# EAGLE design LB_BIT_i15_LIGHTTRIGGER-v03(rev3_2x) (EAGLE 6.1)
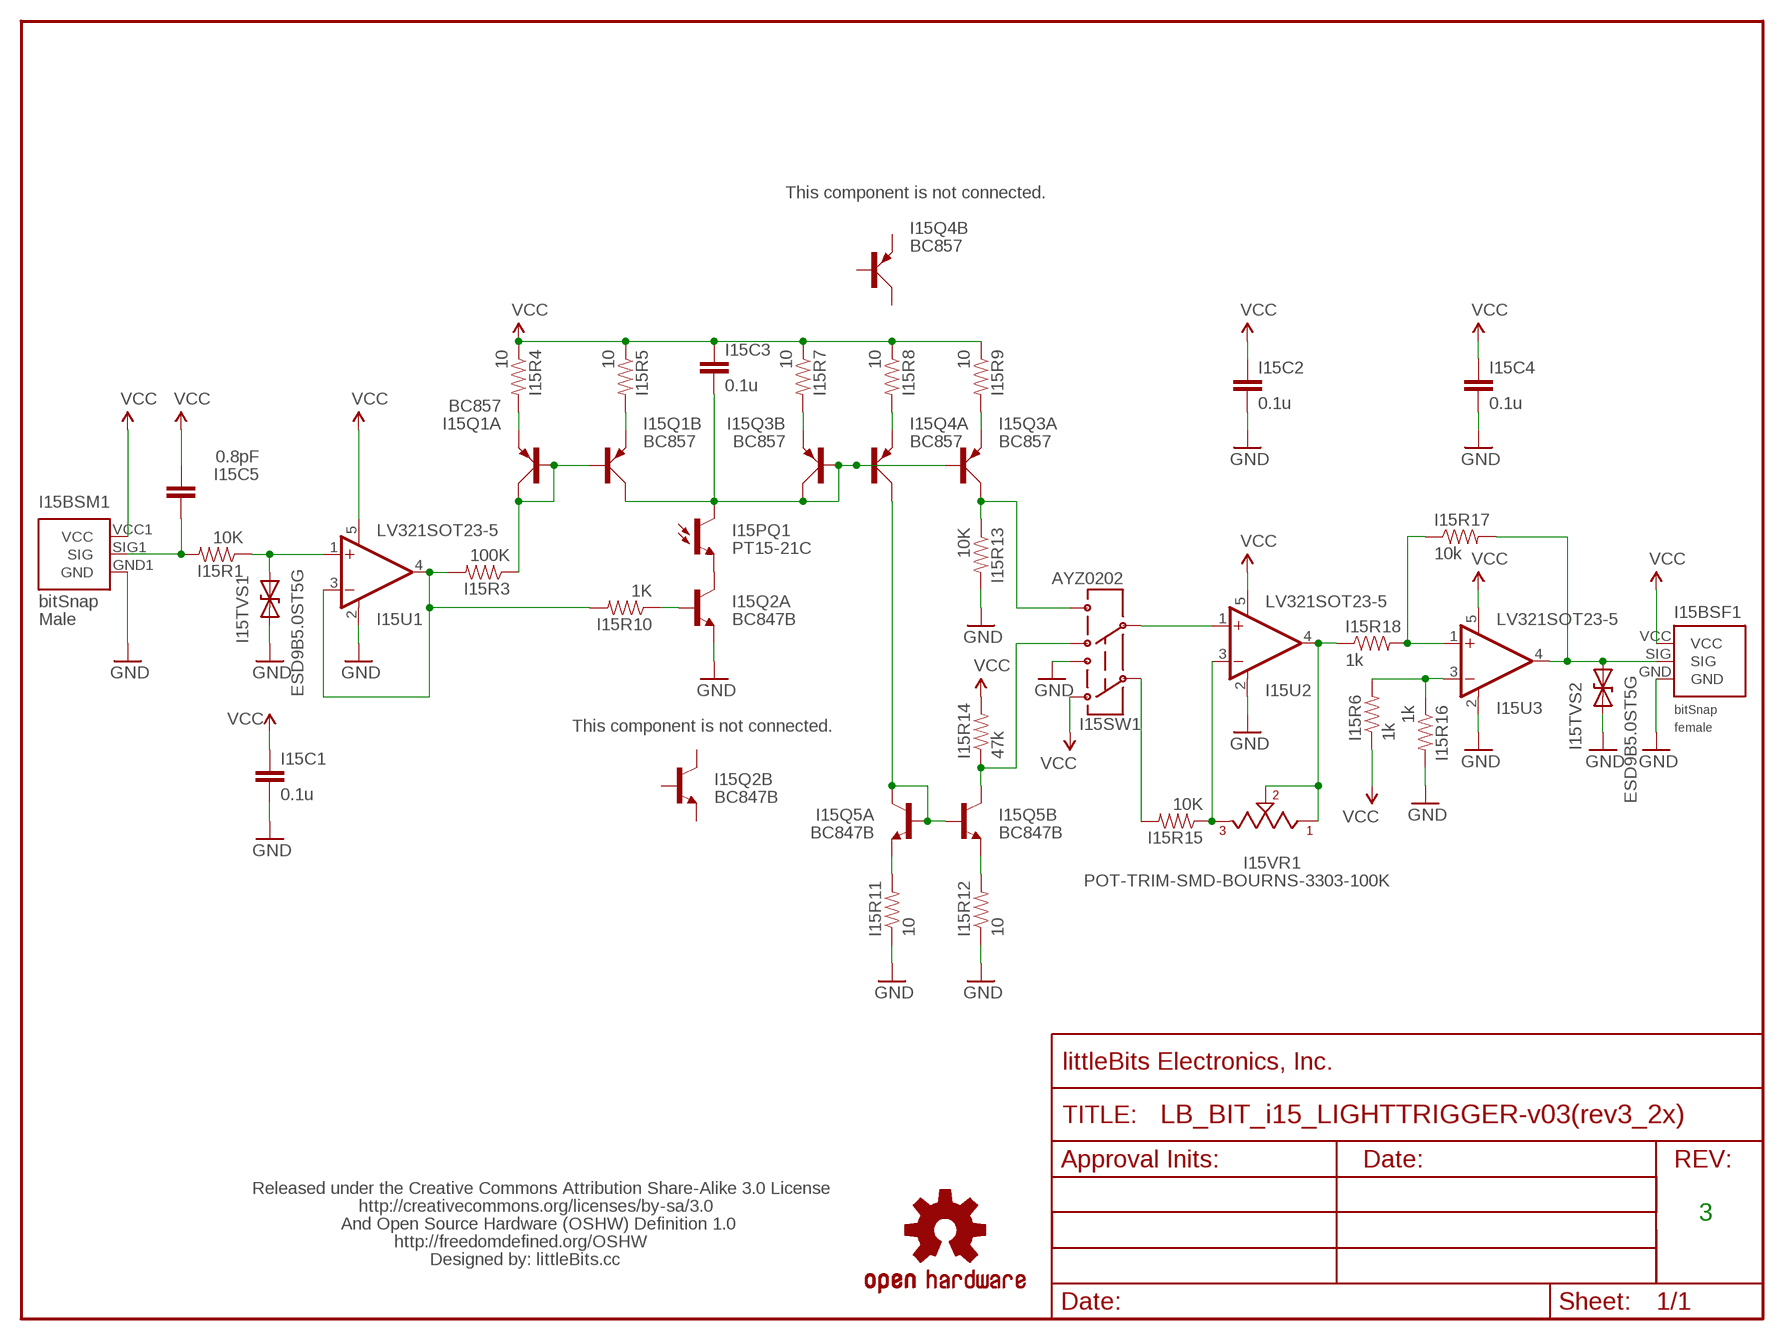
[diagram p0: schematic, sheet 1]

## Parts
FRAME1  FRAME-LETTER-OHWOHW  [FABDWG01-OHW]
I15BSF1  BITSNAP_V03_FEMALE  [BITSNAP_V03_FEMALE]
I15BSM1  BITSNAP_V03_MALE  [BITSNAP_V03_MALE]
I15C1  0.1u  CAPCAP-0603  [CAP-0603]
I15C2  0.1u  CAPCAP-0603  [CAP-0603]
I15C3  0.1u  CAPCAP-0603  [CAP-0603]
I15C4  0.1u  CAPCAP-0603  [CAP-0603]
I15C5  0.8pF  CAPCAP-0603  [CAP-0603]
I15PQ1  PT15-21C  TRANS-PHOTO  [PHOTOTRANS-1206]
I15Q1  BC857  TRANS-BJT_PNP-DUALBC857  [SOT-363_PHILLIPS]
I15Q2  BC847B  TRANS-BJT_NPN-DUALBC847BS  [SOT-363_PHILLIPS]
I15Q3  BC857  TRANS-BJT_PNP-DUALBC857  [SOT-363_PHILLIPS]
I15Q4  BC857  TRANS-BJT_PNP-DUALBC857  [SOT-363_PHILLIPS]
I15Q5  BC847B  TRANS-BJT_NPN-DUALBC847BS  [SOT-363_PHILLIPS]
I15R1  10K  RESISTOR0603  [RES-0603]
I15R3  100K  RESISTOR0603  [RES-0603]
I15R4  10  RESISTOR0603  [RES-0603]
I15R5  10  RESISTOR0603  [RES-0603]
I15R6  1k  RES-0603  [RES-0603]
I15R7  10  RESISTOR0603  [RES-0603]
I15R8  10  RESISTOR0603  [RES-0603]
I15R9  10  RESISTOR0603  [RES-0603]
I15R10  1K  RESISTOR0603  [RES-0603]
I15R11  10  RESISTOR0603  [RES-0603]
I15R12  10  RESISTOR0603  [RES-0603]
I15R13  10K  RESISTOR0603  [RES-0603]
I15R14  47k  RESISTOR0603  [RES-0603]
I15R15  10K  RES-0603  [RES-0603]
I15R16  1k  RES-0603  [RES-0603]
I15R17  10k  RES-0603  [RES-0603]
I15R18  1k  RES-0603  [RES-0603]
I15SW1  AYZ0202  [AYZ0202]
I15TVS1  ESD9B5.0ST5G  DIODE-TVSSOD-923  [SOD-923]
I15TVS2  ESD9B5.0ST5G  DIODE-TVSSOD-923  [SOD-923]
I15U1  LV321SOT23-5  [SOT23-5]
I15U2  LV321SOT23-5  [SOT23-5]
I15U3  LV321SOT23-5  [SOT23-5]
I15VR1  POT-TRIM-SMD-BOURNS-3303-100K  POT-TRIM-SMD-BOURNS-3303  [POT-TRIM-SMD-BOURNS-3303]
U$1  OSHWCREDIT  [OSHWCREDIT]
U$2  OSHW-LOGOL  [OSHW-LOGO-L]

## Nets
GND: I15BSF1.GND I15BSM1.GND1(GND) I15C1.2 I15C2.2 I15C4.2 I15Q2.1(A:E) I15R11.1 I15R12.1 I15R13.2 I15R16.2 I15SW1.3 I15TVS1.1(A) I15TVS2.1(A) I15U1.2(V-) I15U2.2(V-) I15U3.2(V-)
N$1: I15Q5.3(B:C) I15R14.1 I15SW1.4
N$2: I15Q5.1(A:E) I15R11.2
N$3: I15Q4.6(A:C) I15Q5.2(A:B) I15Q5.5(B:B) I15Q5.6(A:C)
N$4: I15Q5.4(B:E) I15R12.2
N$5: I15BSM1.SIG1(SIG) I15C5.1 I15R1.2
N$6: I15R15.1 I15U2.3(-IN) I15VR1.3
N$7: I15R18.1 I15U2.4(OUT) I15VR1.1 I15VR1.2
N$8: I15R3.2 I15R10.2 I15U1.3(-IN) I15U1.4(OUT)
N$9: I15Q1.2(A:B) I15Q1.5(B:B) I15Q1.6(A:C) I15R3.1
N$10: I15Q1.1(A:E) I15R4.2
N$11: I15Q1.4(B:E) I15R5.2
N$12: I15Q3.4(B:E) I15R7.2
N$13: I15C3.2 I15PQ1.C I15Q1.3(B:C) I15Q3.2(A:B) I15Q3.3(B:C) I15Q3.5(B:B) I15Q4.2(A:B)
N$14: I15Q4.1(A:E) I15R8.2
N$15: I15Q3.1(A:E) I15R9.2
N$16: I15SW1.5 I15U2.1(+IN)
N$17: I15R15.2 I15SW1.2
N$18: I15PQ1.E I15Q2.6(A:C)
N$19: I15Q3.6(A:C) I15R13.1 I15SW1.6
N$20: I15Q2.2(A:B) I15R10.1
N$21: I15R1.1 I15TVS1.2(C) I15U1.1(+IN)
N$22: I15R6.2 I15R16.1 I15U3.3(-IN)
N$23: I15R17.1 I15R18.2 I15U3.1(+IN)
N$24: I15BSF1.SIG I15R17.2 I15TVS2.2(C) I15U3.4(OUT)
VCC: I15BSF1.VCC I15BSM1.VCC1(VCC) I15C1.1 I15C2.1 I15C3.1 I15C4.1 I15C5.2 I15R4.1 I15R5.1 I15R6.1 I15R7.1 I15R8.1 I15R9.1 I15R14.2 I15SW1.1 I15U1.5(V+) I15U2.5(V+) I15U3.5(V+)
Unconnected: I15Q2.3(B:C) I15Q2.4(B:E) I15Q2.5(B:B) I15Q4.3(B:C) I15Q4.4(B:E) I15Q4.5(B:B)

## Notes on the sheet
- This component is not connected.
- This component is not connected.
- 3

## Library data of the parts
FRAME1 = LITTLEBITS:FRAME-LETTER-OHW
I15BSF1 = bitSnap:BITSNAP_V03_FEMALE
I15BSM1 = bitSnap:BITSNAP_V03_MALE
I15C1-I15C5 = LITTLEBITS:CAP
I15PQ1 = LITTLEBITS:TRANS-PHOTO
I15Q1 I15Q3 I15Q4 = LITTLEBITS:TRANS-BJT_PNP-DUAL
I15Q2 I15Q5 = LITTLEBITS:TRANS-BJT_NPN-DUAL
I15R1 I15R3-I15R5 I15R7-I15R14 = LITTLEBITS:RESISTOR
I15R6 I15R15-I15R18 = LITTLEBITS:RES-0603: Resistor
I15SW1 = LITTLEBITS:AYZ0202
I15TVS1 I15TVS2 = LITTLEBITS:DIODE-TVS: Bidirectional Transient Voltage Suppression Diode: Device conducts in avalanche mode after reaching a part dependent voltage threshold. Used for limiting voltage spikes on ESD sensitive inputs and outputs.; IEC_ESD_PROT0: +/-18kV; LB_PN: ?; MPN: ESD9B5.0ST5G; V_CLAMP: ?; V_OPERATION: 5V
I15U1-I15U3 = LITTLEBITS:LV321
I15VR1 = LITTLEBITS:POT-TRIM-SMD-BOURNS-3303
U$1 = LITTLEBITS:OSHWCREDIT
U$2 = LITTLEBITS:OSHW-LOGO: Open Source Hardware Logo This logo indicates the piece of hardware it is found on incorporates a OSHW license and/or adheres to the definition of open source hardware found here: http://freedomdefined.org/OSHW

## Board
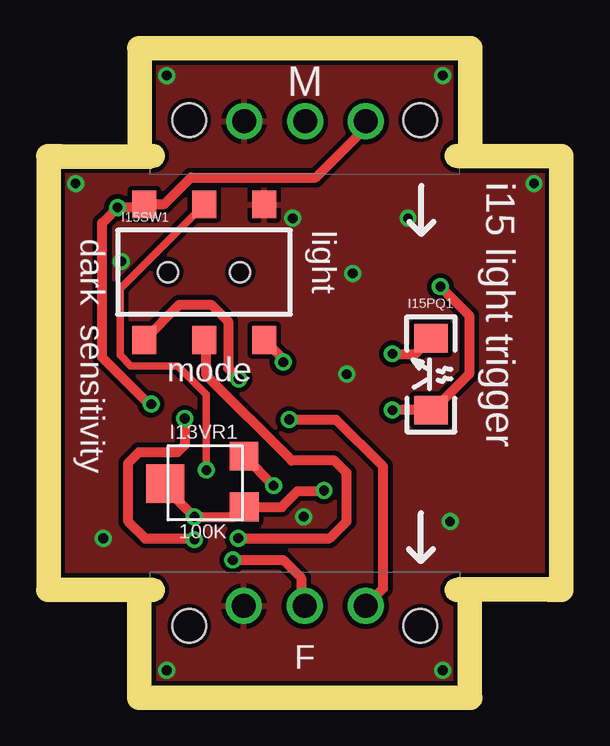
[diagram p1: board, top side]
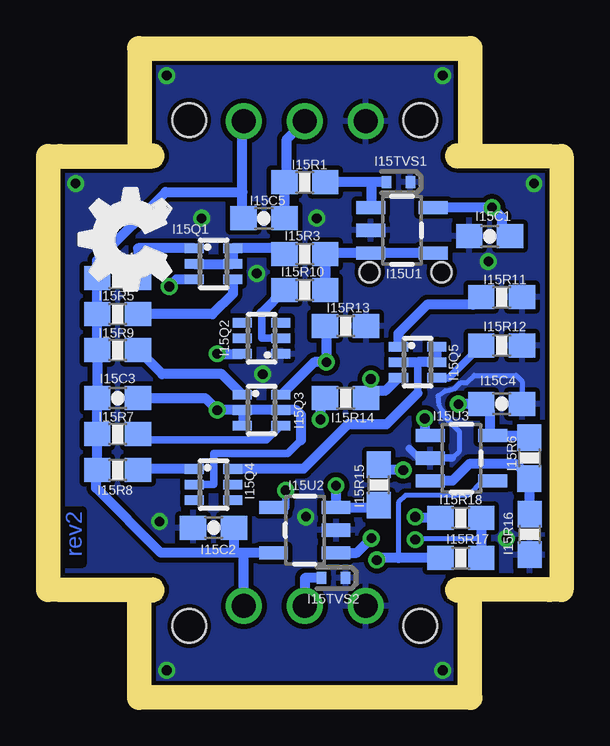
[diagram p2: board, bottom side, seen from below]

Size 20.4 x 26.1 mm. Coordinates in mm from the lower left corner, seen from the top.
Outline: 0,21.6 0,4.5
Outline: 20.4,4.5 20.4,21.6
Copper layers (1*16): Top 0.035mm / dielectric 1.5mm / Bottom 0.035mm
Design rules "default": minimum track width 0.2mm, minimum drill 0.4mm, track to track 0.2mm, track to pad 0.2mm, pad to pad 0.2mm, via to via 0.2mm, smd to smd 0mil, copper to edge 0.2mm, drill to drill 0.2mm, minimum pad ring 0.2mm, minimum via ring 0.15mm, stop-mask expansion 0.1mm, vias tented up to drill 0mil, thermal gap 0.2mm
Milling: 6 lines

### Footprints (pad centres in the part's own frame; a part is rotated, then mirrored left to right if it is on the bottom)
BITSNAP_V03_FEMALE = drill 1: GND 3.91,3.33; SIG 6.45,3.33; VCC 8.99,3.33 | hole 1.4: 1.63,2.5; 11.27,2.5
BITSNAP_V03_MALE = drill 1: GND1 8.98,2.56; SIG1 6.44,2.56; VCC1 3.9,2.56 | hole 1.4: 11.27,2.5; 1.63,2.5
CAP-0603 = smd 1.1 x 1: 1 -0.85,0; 2 0.85,0
PHOTOTRANS-1206 = smd 1.2 x 1.4: C -1.5,0; E 1.5,0
SOT-363_PHILLIPS = smd 0.4 x 0.8: 1 -0.65,-0.8; 2 0,-0.8; 3 0.65,-0.8; 4 0.65,0.8; 5 0,0.8; 6 -0.65,0.8
RES-0603 = smd 1.1 x 1: 1 -0.85,0; 2 0.85,0
AYZ0202 = smd 1 x 1.15: 1 -2.5,2.825; 2 0,2.825; 3 2.5,2.825; 4 -2.5,-2.825; 5 0,-2.825; 6 2.5,-2.825 | hole 0.85: 1.5,0; -1.5,0
SOD-923 = smd 0.4 x 0.5: 1 -0.5,0; 2 0.5,0
SOT23-5 = smd 0.55 x 1.2: 1 -0.95,-1.3; 2 0,-1.3; 3 0.95,-1.3; 4 0.95,1.3; 5 -0.95,1.3
POT-TRIM-SMD-BOURNS-3303 = smd 1.2 x 1.2: 1 0.543,-3.172; 3 2.66,-3.168 | smd 1.6 x 1.6: 2 1.52,0.115

### Placement (x,y rotation side)
FRAME1  -145.85,-76.5 0 top  (outside the outline)
I15BSF1  3.75,0 0 top
I15BSM1  16.65,26.1 180 top
I15C1  2.5,18.75 180 bottom
I15C2  14,6.6 180 bottom
I15C3  18,12 0 bottom
I15C4  2,11.77 0 bottom
I15C5  11.9,19.5 180 bottom
I15PQ1  15.45,13 90 top
I15Q1  14,17.6 270 bottom
I15Q2  12,14.5 90 bottom
I15Q3  12,11.5 270 bottom
I15Q4  14,8.4 270 bottom
I15Q5  5.5,13.5 270 bottom
I15R1  10.2,21 180 bottom
I15R3  10.2,18 0 bottom
I15R4  18,17 0 bottom
I15R5  18,15.5 0 bottom
I15R6  0.84,9.5 270 bottom
I15R7  18,10.5 0 bottom
I15R8  18,9 0 bottom
I15R9  18,14 0 bottom
I15R10  10.2,16.5 0 bottom
I15R11  2,16.21 180 bottom
I15R12  2,14.2 180 bottom
I15R13  8.5,15 0 bottom
I15R14  8.5,12 180 bottom
I15R15  7.11,8.38 90 bottom
I15R16  0.83,6.32 270 bottom
I15R17  3.7,5.34 180 bottom
I15R18  3.7,7 0 bottom
I15SW1  6,17.25 0 top
I15TVS1  6.3,21 180 bottom
I15TVS2  9,4.5 180 bottom
I15U1  6.15,19 270 bottom
I15U2  10.2,6.5 90 bottom
I15U3  3.67,9.5 270 bottom
I15VR1  4.5,6.92 90 top
U$1  -57.9,-73.7 0 top  (outside the outline)
U$2  -24.6,-71.2 0 top  (outside the outline)
U$6  [OSHW_FILLX150_NOTEXT]  15.78,15.66 0 top

### Tracks (layer width: path | path; a pad name or v marks a point on that pad's centre or on a via)
GND  (via drill 0.41)
  Bottom 0.203: 4.05,9.5 3.75,9.8 3.75,10.6 4.45,11.3 4.45,11.45 4.6,11.7 4.65,12.1 4.35,12.3 3.95,12.4 3.7,12.65 3.45,12.65 3.15,12.95 1.4,12.95 1.15,12.7 I15C4.2
  Bottom 0.305: 4.05,9.5 5.45,9.5 5.85,9.9
  Bottom 0.406: 7.6,15.1 I15R13.2
  other vias: 14.5,19.5 16.25,6.85 11.95,13 9.7,19.5 1.8,6.15 12.2,17.2 2.55,17.7 10.15,7.05 4.45,0.65 15.95,0.65 15.95,25.45 4.45,25.45 0.65,20.95 19.75,20.95
  pour Bottom: 0,0 20.4,0 20.4,26.1 0,26.1
  pour Top: 0,0 20.4,0 20.4,26.1 0,26.1
N$1  (via drill 0.41)
  Top 0.406: I15SW1.4 4.97,15.9 6.3,15.9 7,15.2 7,13.25 v7.45,12.8
  Bottom 0.406: I15Q5.3 6.85,12.3 7.25,12.3 I15R14.1 7.6,12.05 7.45,12.3 v7.45,12.8
N$2
  Bottom 0.406: I15R11.2 2.89,16.21 3.2,15.9 5.1,15.9 6.3,14.7 I15Q5.1
N$3
  Bottom 0.305: 5.5,13.5 5.5,12.21
  Bottom 0.406: I15Q5.2 5.5,13.5 I15Q5.5 I15Q5.6 | 5.5,12.21 6.8,10.91 8.4,10.91 10.26,9.05 I15Q4.6
N$4
  Bottom 0.305: I15R12.2 4.2,12.85 I15Q5.4
N$5
  Bottom 0.406: I15C5.1 I15R1.2 10.95,21.15 10.95,22.8 I15BSM1.SIG1
N$6  (via drill 0.41)
  Top 0.305: I15VR1.3 7.41,9.83 7.41,9.31
  Top 0.406: 7.67,9.32 I15VR1.3 v8.9,8.35
  Bottom 0.406: I15U2.3 7.1,7.45 I15R15.1 | v8.9,8.35 I15U2.3 | I15U2.3
N$7  (via drill 0.41)
  Top 0.305: 7.62,7.41 I15VR1.1 7.58,7.37
  Top 0.406: v11,8.15 10.98,8.13 9.91,8.13 9.24,7.46 I15VR1.1 7.26,7.05 v5.6,7.05 4.38,8.27 I15VR1.2
  Bottom 0.305: v11,8.15 11,7.45 I15U2.4
  Bottom 0.406: I15R18.1 5.55,7 v5.6,7.05
N$8
  Bottom 0.406: I15U1.4 I15U1.3 9.35,18.05 I15R10.2 I15R3.2
N$9
  Bottom 0.406: I15Q1.2 I15Q1.5 I15Q1.6 11.15,18.25 I15R3.1
N$10
  Bottom 0.406: I15Q1.1 17.15,18.25 I15R4.2
N$11
  Bottom 0.406: I15Q1.4 13.2,16.35 14.05,15.5 I15R5.2
N$12
  Bottom 0.305: I15Q3.4 11.8,10.25 16.95,10.25
  Bottom 0.406: 16.95,10.25 17.15,10.35 I15R7.2
N$13  (via drill 0.41)
  Top 0.406: v15.85,16.65 17.05,15.45 17.05,13 15.55,11.5 I15PQ1.C v13.85,11.5
  Bottom 0.305: I15Q3.2 I15Q3.3 | I15Q4.2 14,8.4 14,9.7 10.9,9.7 10.35,10.25
  Bottom 0.406: 10.35,10.25 10.35,11.3 10.55,11.5 I15Q3.5 I15Q3.2 v13.85,11.5 14.35,12 I15C3.2 | I15Q1.3 15.55,16.95 v15.85,16.65
N$14
  Bottom 0.406: I15Q4.1 17.35,9.05 I15R8.2
N$15
  Bottom 0.406: I15Q3.1 13.65,13 16.15,13 I15R9.2
N$16  (via drill 0.41)
  Top 0.305: 6.1,14.33 I15SW1.5
  Top 0.406: v7.42,6.16 11.24,6.16 11.94,6.86 11.94,8.89 11.43,9.4 9.65,9.4 6.1,12.95 6.1,14.33
  Bottom 0.406: I15U2.1 8.03,5.55 v7.42,6.16
N$17  (via drill 0.41)
  Top 0.305: I15SW1.2 2.5,16.57 2.5,13.8 2.95,13.35 4.9,13.35 6.1,12.15 v6.1,9
  Bottom 0.203: I15R15.2 7.11,9.44
  Bottom 0.305: 7.11,9.44 7.06,9.44 | 6.88,9 I15R15.2
  Bottom 0.406: v6.1,9 6.88,9
N$18  (via drill 0.41)
  Top 0.406: v13.85,13.85 14.8,13.85 I15PQ1.E
  Bottom 0.406: v13.85,13.85 I15Q2.6
N$19  (via drill 0.41)
  Top 0.406: I15SW1.6 9.3,13.62 v9.3,13.5
  Bottom 0.406: I15Q3.6 11.15,12.15 9.8,13.5 v9.3,13.5 9.3,14.95 I15R13.1
N$20
  Bottom 0.305: 12,15.55 12,14.5 I15Q2.2
  Bottom 0.406: I15R10.1 12,15.55
N$21
  Bottom 0.305: 7.5,19.95 7.4,20.05
  Bottom 0.406: 7.5,19.95 I15U1.1 | I15TVS1.2 7.4,21 | 7.4,21 I15R1.1 | 7.4,20.05 7.4,21
N$22
  Bottom 0.305: I15R6.2 0.84,8.69
  Bottom 0.406: I15R6.2 I15R16.1 | 0.84,8.69 1.4,9.25 3.35,9.25 4.05,8.55 I15U3.3
N$23  (via drill 0.41)
  Top 0.406: v5.6,6.1 5.4,6.15 3.55,6.15 2.85,6.85 2.85,9.3 3.3,9.75 4.9,9.75 5.2,10.05 v5.2,11.15
  Bottom 0.203: 2.85,6.15 5.55,6.15 v5.6,6.1
  Bottom 0.406: I15R18.2 2.85,6.15 I15R17.1 | v5.2,11.15 5.2,10.68 I15U3.1
N$24  (via drill 0.41)
  Top 0.406: v7.2,5.25 9.3,5.25 10.05,4.5 10.05,3.48 I15BSF1.SIG
  Bottom 0.203: I15U3.4 2.8,8.55 3.4,7.95 6,7.95 6.3,7.65 6.3,5.34
  Bottom 0.406: I15TVS2.2 10.2,4.5 I15BSF1.SIG | I15R17.2 6.3,5.34 7.11,5.34 v7.2,5.25
VCC  (via drill 0.41)
  Top 0.406: v9.55,11.11 11.5,11.11 13.46,9.14 13.46,4.06 12.74,3.34 I15BSF1.VCC | I15BSM1.VCC1 12.75,23.3 10.65,21.2 5.45,21.2 4.35,20.1 3.52,20.1 I15SW1.1 3.48,19.95 v2.4,19.95 1.75,19.3 1.75,13.7 3.65,11.8 v3.8,11.75
  Bottom 0.305: 12.74,5.49 12.8,5.55 | 2,19.1 I15C1.1 | I15C4.1 2.83,11.77
  Bottom 0.406: 12.8,20.6 12.8,23.39 I15BSM1.VCC1 | I15U2.5 12.8,5.55 13.15,5.55 | 13.15,5.55 16.2,5.55 18.9,8.25 18.9,8.7 I15R8.1 I15R7.1 I15C3.1 I15R9.1 I15R5.1 I15R4.1 18.85,17.75 16,20.6 12.8,20.6 | I15R14.2 9.55,11.95 v9.55,11.11 | I15U1.5 v2.4,19.95 2,19.55 2,19.1 | I15BSF1.VCC 12.74,5.49 | I15C2.1 13.15,5.55 | I15C5.2 12.8,19.5 12.8,20.6 | I15R6.1 0.94,10.45 I15U3.5 2.5,10.58 2.5,11.5 2.77,11.77 I15C4.1 3.82,11.77 v3.8,11.75

### Text on the board
Bottom: rev2
tPlace: i15 light trigger | dark sensitivity | light | mode
tNames: I13VR1 | 100K
Reference: MEDIUM
dxf: 2